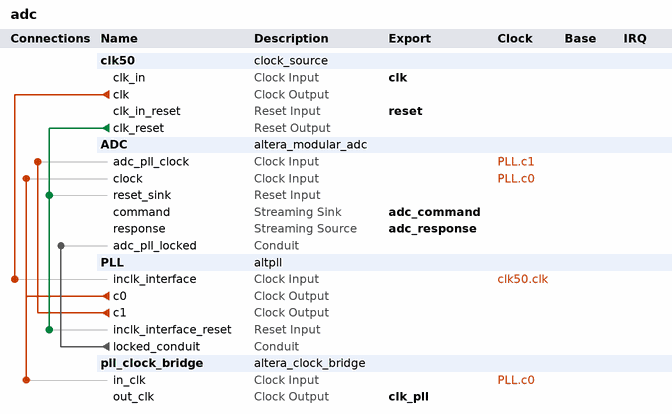
[diagram p0: system contents]
# Platform Designer (Qsys) system adc, MAX 10 10M50DAF484C7G
# Parameters at their usual value, and those the tool derives, are not listed.
package require -exact qsys 17.1
create_system adc
set_project_property DEVICE_FAMILY {MAX 10}
set_project_property DEVICE 10M50DAF484C7G

add_instance clk50 clock_source 17.1
set_instance_parameter_value clk50 clockFrequency 50000000

add_instance ADC altera_modular_adc 17.1
set_instance_parameter_value ADC CLOCK_FREQ 25000000
set_instance_parameter_value ADC CORE_VAR 3
set_instance_parameter_value ADC DEVICE_PART 10M50DAF484C7G
set_instance_parameter_value ADC clkdiv 2
set_instance_parameter_value ADC int_vref_vr 3.0
set_instance_parameter_value ADC refsel 0
set_instance_parameter_value ADC sample_rate 0
set_instance_parameter_value ADC seq_order_length 1
set_instance_parameter_value ADC seq_order_slot_1 30
set_instance_parameter_value ADC seq_order_slot_2 30
set_instance_parameter_value ADC seq_order_slot_3 30
set_instance_parameter_value ADC seq_order_slot_4 30
set_instance_parameter_value ADC seq_order_slot_5 30
set_instance_parameter_value ADC seq_order_slot_6 30
set_instance_parameter_value ADC seq_order_slot_7 30
set_instance_parameter_value ADC use_ch0 false
set_instance_parameter_value ADC use_ch2 true
set_instance_parameter_value ADC use_ch3 true
set_instance_parameter_value ADC use_ch4 false
set_instance_parameter_value ADC use_ch5 false
set_instance_parameter_value ADC use_ch6 false
set_instance_parameter_value ADC use_ch7 false
set_instance_parameter_value ADC use_ch8 false
set_instance_parameter_value ADC use_tsd false

add_instance PLL altpll 17.1
set_instance_parameter_value PLL CLK0_DIVIDE_BY 2
set_instance_parameter_value PLL CLK0_MULTIPLY_BY 1
set_instance_parameter_value PLL CLK1_DIVIDE_BY 5
set_instance_parameter_value PLL CLK1_DUTY_CYCLE 50
set_instance_parameter_value PLL CLK1_MULTIPLY_BY 1
set_instance_parameter_value PLL CLK1_PHASE_SHIFT 0
set_instance_parameter_value PLL INCLK0_INPUT_FREQUENCY 20000
set_instance_parameter_value PLL PORT_ARESET PORT_UNUSED
set_instance_parameter_value PLL PORT_LOCKED PORT_USED
set_instance_parameter_value PLL PORT_clk1 PORT_USED
set_instance_parameter_value PLL PORT_clk2 PORT_UNUSED
set_instance_parameter_value PLL PORT_clk3 PORT_UNUSED

add_instance pll_clock_bridge altera_clock_bridge 17.1
set_instance_parameter_value pll_clock_bridge DERIVED_CLOCK_RATE 25000000
set_instance_parameter_value pll_clock_bridge EXPLICIT_CLOCK_RATE 0

# connections
add_connection clk50.clk PLL.inclk_interface clock
add_connection PLL.c0 ADC.clock clock
add_connection PLL.c0 pll_clock_bridge.in_clk clock
add_connection PLL.c1 ADC.adc_pll_clock clock
add_connection clk50.clk_reset ADC.reset_sink reset
add_connection clk50.clk_reset PLL.inclk_interface_reset reset
add_connection PLL.locked_conduit ADC.adc_pll_locked conduit

# exported interfaces
add_interface adc_command avalon_streaming sink
set_interface_property adc_command EXPORT_OF ADC.command
add_interface adc_response avalon_streaming source
set_interface_property adc_response EXPORT_OF ADC.response
add_interface clk clock sink
set_interface_property clk EXPORT_OF clk50.clk_in
add_interface clk_pll clock source
set_interface_property clk_pll EXPORT_OF pll_clock_bridge.out_clk
add_interface reset reset sink
set_interface_property reset EXPORT_OF clk50.clk_in_reset

set_interconnect_requirement {$system} qsys_mm.clockCrossingAdapter HANDSHAKE
set_interconnect_requirement {$system} qsys_mm.enableEccProtection FALSE
set_interconnect_requirement {$system} qsys_mm.insertDefaultSlave FALSE
set_interconnect_requirement {$system} qsys_mm.maxAdditionalLatency 1

save_system adc.qsys
